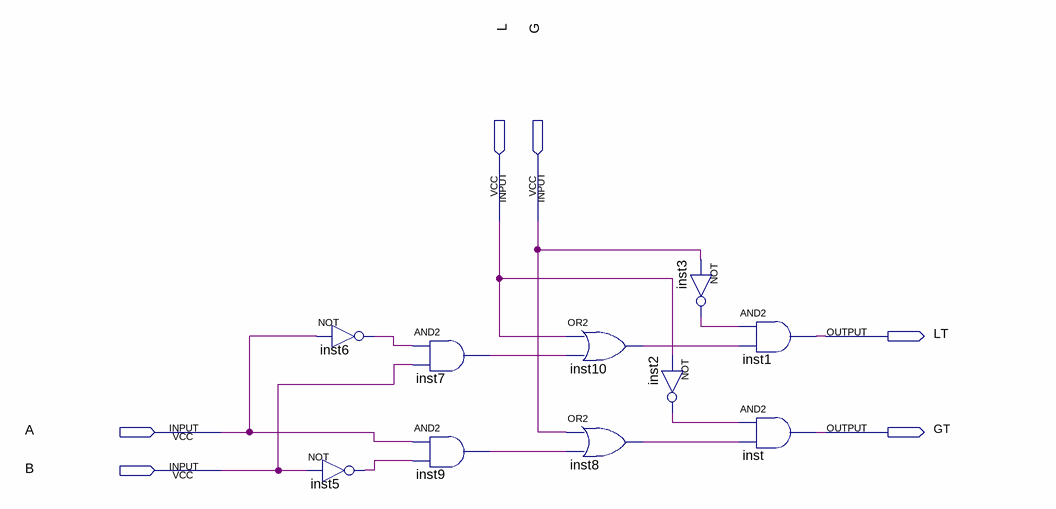
[diagram p0: schematic sheet]
// Quartus schematic comparador_Novo.bdf as structural Verilog: 10 symbols, 6 pins
module comparador_Novo (
  input  L,
  input  G,
  input  A,
  input  B,
  output LT,
  output GT
);

  wire inst2_out, inst3_out, inst5_out, inst6_out, inst7_out, inst8_out, inst9_out, inst10_out;

  not inst6 (inst6_out, A);
  not inst5 (inst5_out, B);
  and inst7 (inst7_out, inst6_out, B);
  and inst9 (inst9_out, A, inst5_out);
  or inst10 (inst10_out, L, inst7_out);
  or inst8 (inst8_out, G, inst9_out);
  not inst3 (inst3_out, G);
  not inst2 (inst2_out, L);
  and inst1 (LT, inst3_out, inst10_out);
  and inst (GT, inst2_out, inst8_out);
endmodule
